# EAGLE schematic Oscilloscope (EAGLE 9.7.0)

## Sheet 1 of 3
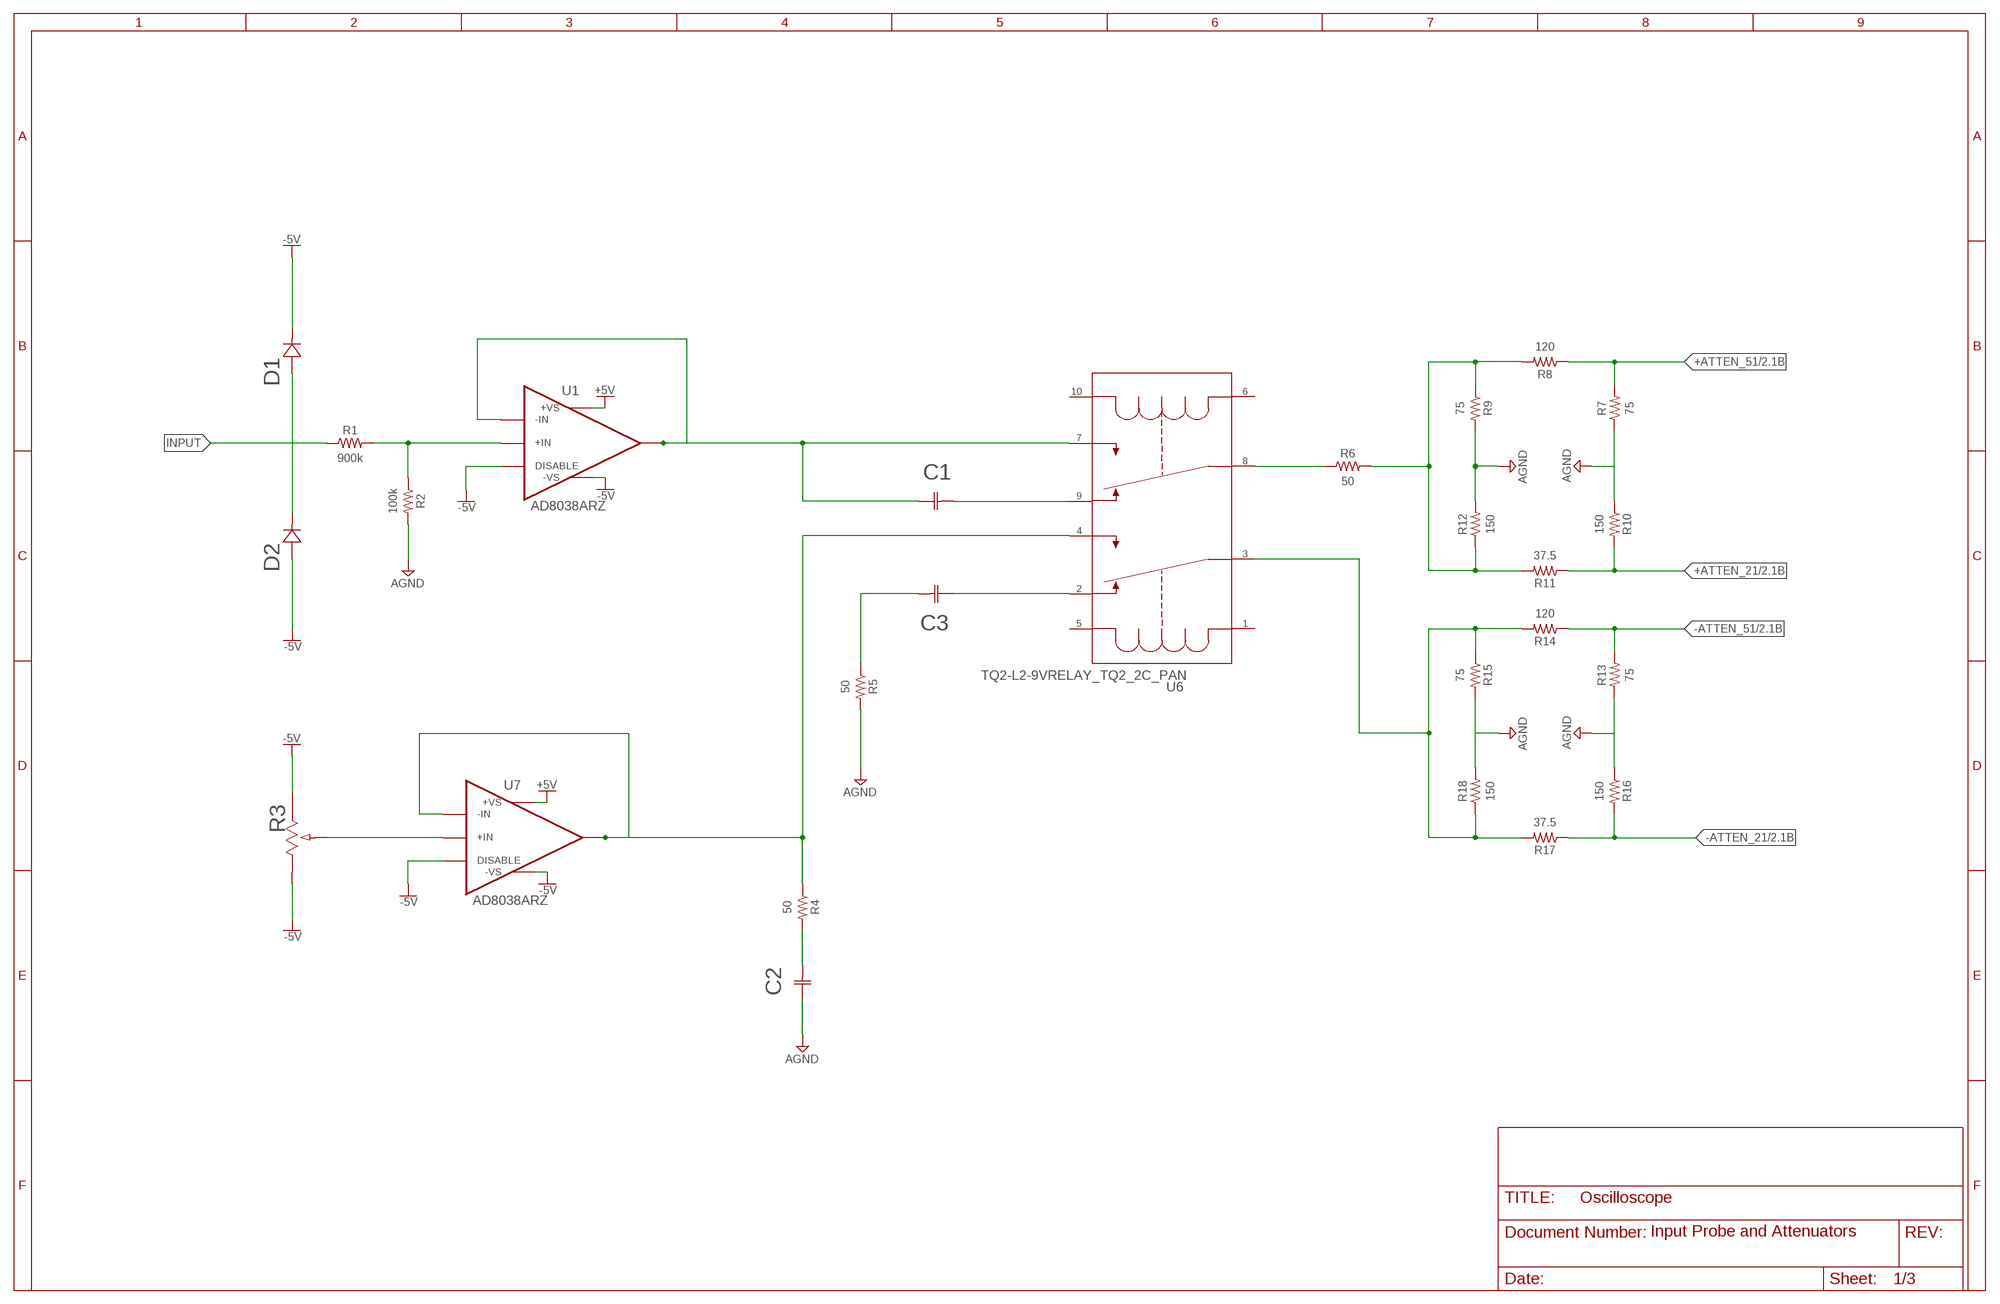
[diagram p0: schematic, sheet 1]

### Parts
C1  C1005X7R1V104K050BBCAP_1005_TDK-L  [CAP_1005_TDK-L]
C2  C1005X7R1V104K050BBCAP_1005_TDK-L  [CAP_1005_TDK-L]
C3  C1005X7R1V104K050BBCAP_1005_TDK-L  [CAP_1005_TDK-L]
D1  NSR05F40NXT5GCR_NSR05_ONS-L  [CR_NSR05_ONS-L]
D2  NSR05F40NXT5GCR_NSR05_ONS-L  [CR_NSR05_ONS-L]
R1  900k  R-US_AXIAL-7.2MM-PITCH  [RESAD724W46L381D178B]
R2  100k  R-US_AXIAL-7.2MM-PITCH  [RESAD724W46L381D178B]
R3  3386P-1-103TLFPOT_3386P  [POT_3386P]
R4  50  R-US_AXIAL-7.2MM-PITCH  [RESAD724W46L381D178B]
R5  50  R-US_AXIAL-7.2MM-PITCH  [RESAD724W46L381D178B]
R6  50  R-US_AXIAL-7.2MM-PITCH  [RESAD724W46L381D178B]
R7  75  R-US_AXIAL-7.2MM-PITCH  [RESAD724W46L381D178B]
R8  120  R-US_AXIAL-7.2MM-PITCH  [RESAD724W46L381D178B]
R9  75  R-US_AXIAL-7.2MM-PITCH  [RESAD724W46L381D178B]
R10  150  R-US_AXIAL-7.2MM-PITCH  [RESAD724W46L381D178B]
R11  37.5  R-US_AXIAL-7.2MM-PITCH  [RESAD724W46L381D178B]
R12  150  R-US_AXIAL-7.2MM-PITCH  [RESAD724W46L381D178B]
R13  75  R-US_AXIAL-7.2MM-PITCH  [RESAD724W46L381D178B]
R14  120  R-US_AXIAL-7.2MM-PITCH  [RESAD724W46L381D178B]
R15  75  R-US_AXIAL-7.2MM-PITCH  [RESAD724W46L381D178B]
R16  150  R-US_AXIAL-7.2MM-PITCH  [RESAD724W46L381D178B]
R17  37.5  R-US_AXIAL-7.2MM-PITCH  [RESAD724W46L381D178B]
R18  150  R-US_AXIAL-7.2MM-PITCH  [RESAD724W46L381D178B]
U1  AD8038ARZ  [SOIC127P600X175-8N]
U6  TQ2-L2-9VRELAY_TQ2_2C_PAN  [RELAY_TQ2_2C_PAN]
U7  AD8038ARZ  [SOIC127P600X175-8N]

### Nets
+5V: U1.7(+VS) U7.7(+VS) ; also sheet 2,3
+ATTEN_21: R10.2 R11.1 ; also sheet 2
+ATTEN_51: R7.2 R8.1 ; also sheet 2
-5V: D1.1 D2.2 R3.1 R3.3 U1.4(-VS) U1.8(DISABLE) U7.4(-VS) U7.8(DISABLE) ; also sheet 2,3
-ATTEN_21: R16.2 R17.1 ; also sheet 2
-ATTEN_51: R13.2 R14.1 ; also sheet 2
AGND: C2.1 R5.2 R7.1 R9.2 R10.1 R12.2 R13.1 R15.2 R16.1 R18.2 ; also sheet 2,3
AGND1: R6.2 R8.2 R9.1 R11.2 R12.1
AGND3: R14.2 R15.1 R17.2 R18.1 U6.3(3_2)
INPUT: R1.1
N$1: R1.2 R2.1 U1.3(+IN)
N$2: C1.2 U6.9
N$3: R2.2 ; supply symbol labelled AGND
N$4: R3.2 U7.3(+IN)
N$5: D1.2 D2.1
N$7: C1.1 U1.2(-IN) U1.6(VOUT) U6.7
N$8: R4.1 U6.4 U7.2(-IN) U7.6(VOUT)
N$9: C2.2 R4.2
N$10: C3.1 U6.2
N$11: C3.2 R5.1
N$12: R6.1 U6.8
Unconnected: U6.1 U6.5 U6.6 U6.10

### Notes on the sheet
- Input Probe and Attenuators

## Sheet 2 of 3
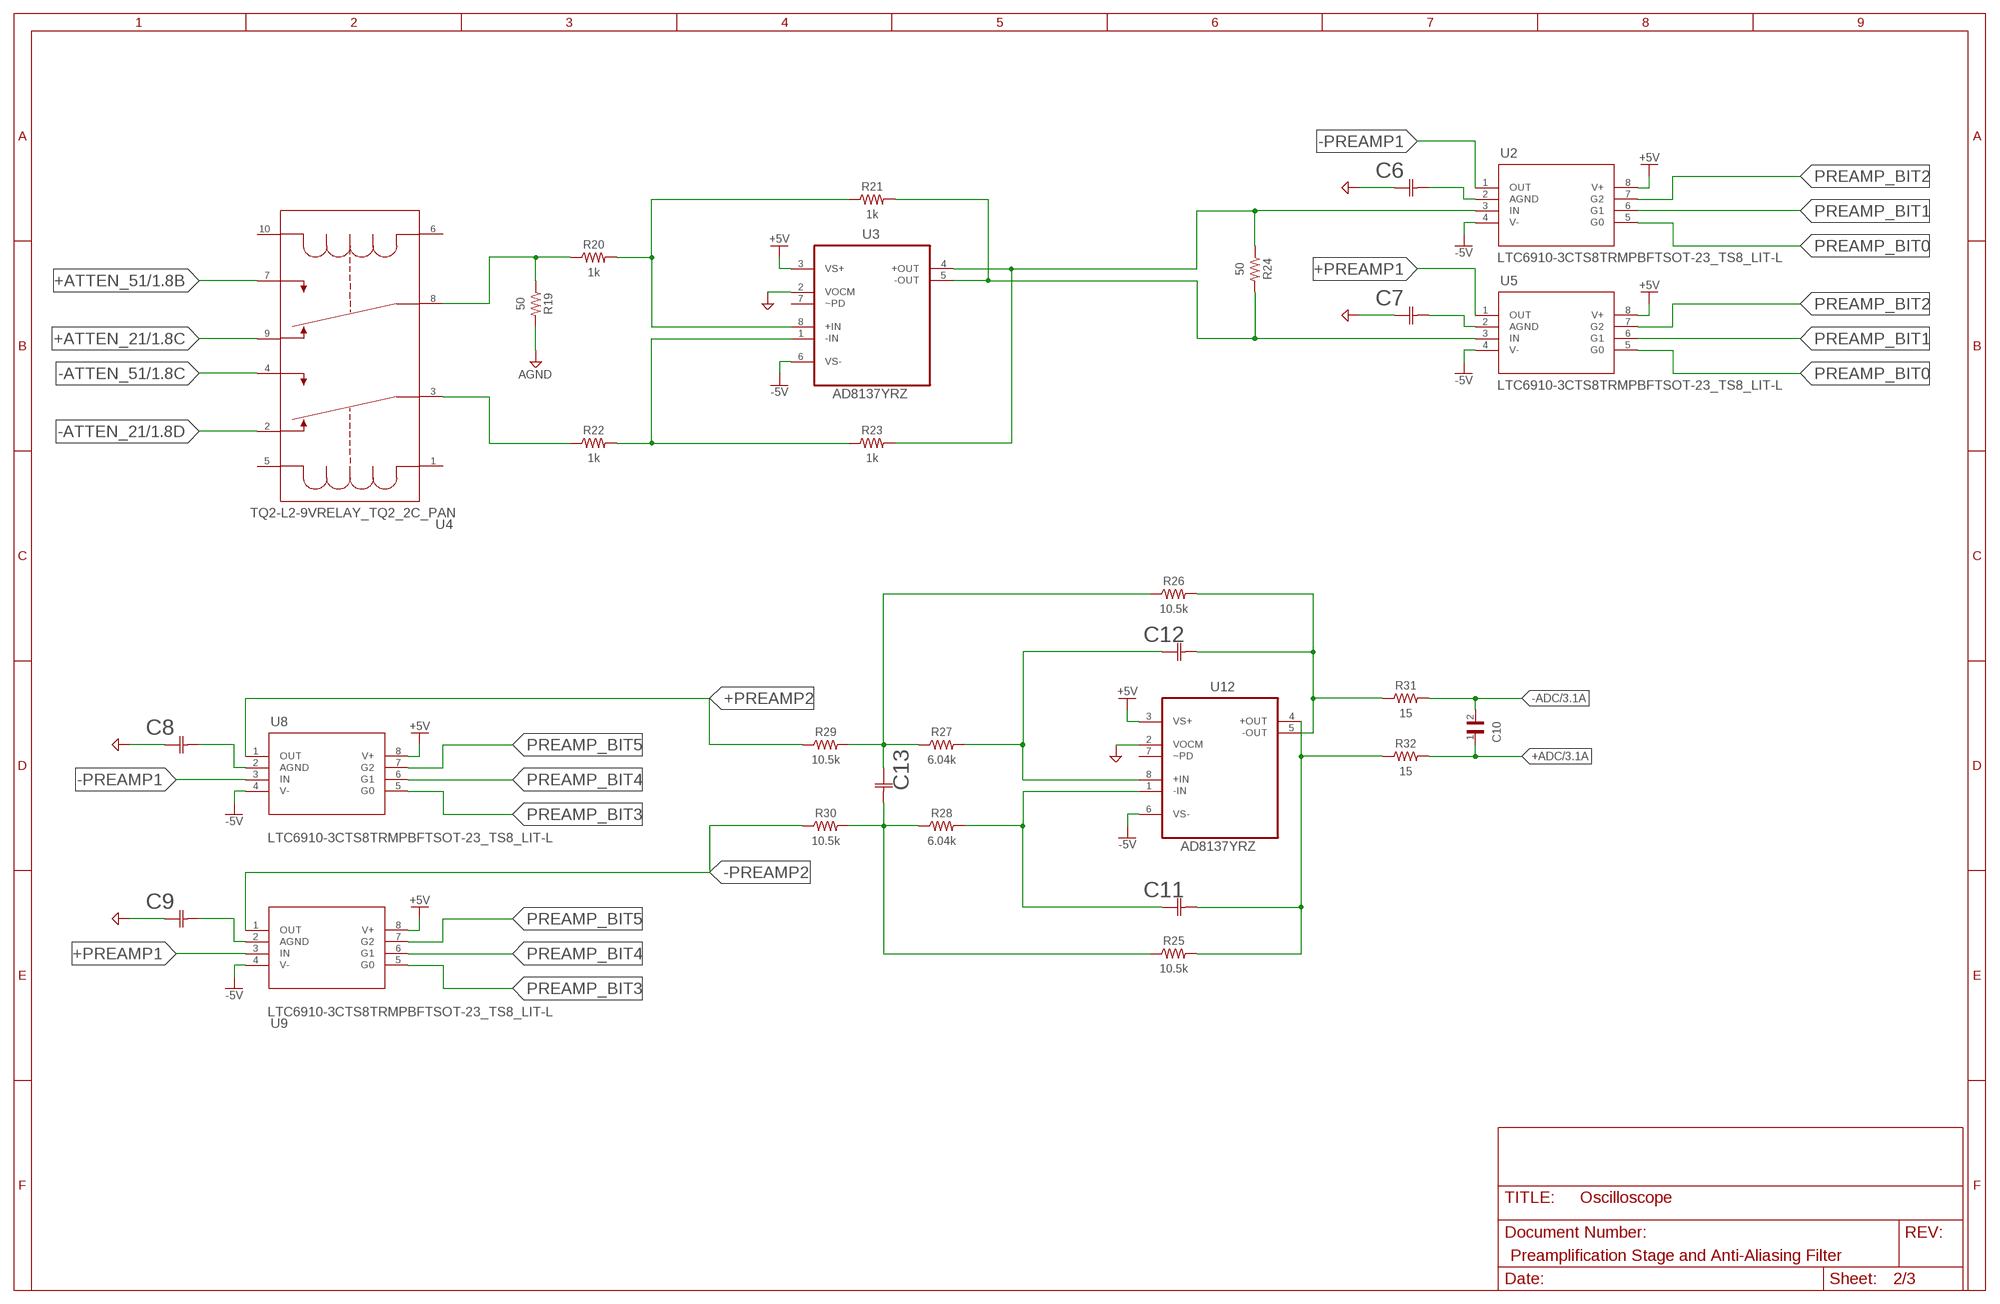
[diagram p1: schematic, sheet 2]

### Parts
C6  C0402C105K9PACTUCAPC10555_55N_KEM-L  [CAPC10555_55N_KEM-L]
C7  C0402C105K9PACTUCAPC10555_55N_KEM-L  [CAPC10555_55N_KEM-L]
C8  C0402C105K9PACTUCAPC10555_55N_KEM-L  [CAPC10555_55N_KEM-L]
C9  C0402C105K9PACTUCAPC10555_55N_KEM-L  [CAPC10555_55N_KEM-L]
C10  CC0603JRNPO9BN501  [CAPC1608X90]
C11  CC0603JRNPO9BN100CAP_CC0603_YAG-L  [CAP_CC0603_YAG-L]
C12  CC0603JRNPO9BN100CAP_CC0603_YAG-L  [CAP_CC0603_YAG-L]
C13  CC0603JRNPO9BN200YAG_CC0603_YAG-L  [YAG_CC0603_YAG-L]
R19  50  R-US_AXIAL-7.2MM-PITCH  [RESAD724W46L381D178B]
R20  1k  R-US_AXIAL-7.2MM-PITCH  [RESAD724W46L381D178B]
R21  1k  R-US_AXIAL-7.2MM-PITCH  [RESAD724W46L381D178B]
R22  1k  R-US_AXIAL-7.2MM-PITCH  [RESAD724W46L381D178B]
R23  1k  R-US_AXIAL-7.2MM-PITCH  [RESAD724W46L381D178B]
R24  50  R-US_AXIAL-7.2MM-PITCH  [RESAD724W46L381D178B]
R25  10.5k  R-US_AXIAL-7.2MM-PITCH  [RESAD724W46L381D178B]
R26  10.5k  R-US_AXIAL-7.2MM-PITCH  [RESAD724W46L381D178B]
R27  6.04k  R-US_AXIAL-7.2MM-PITCH  [RESAD724W46L381D178B]
R28  6.04k  R-US_AXIAL-7.2MM-PITCH  [RESAD724W46L381D178B]
R29  10.5k  R-US_AXIAL-7.2MM-PITCH  [RESAD724W46L381D178B]
R30  10.5k  R-US_AXIAL-7.2MM-PITCH  [RESAD724W46L381D178B]
R31  15  R-US_AXIAL-7.2MM-PITCH  [RESAD724W46L381D178B]
R32  15  R-US_AXIAL-7.2MM-PITCH  [RESAD724W46L381D178B]
U2  LTC6910-3CTS8TRMPBFTSOT-23_TS8_LIT-L  [TSOT-23_TS8_LIT-L]
U3  AD8137YRZ  [SOIC127P600X175-8N]
U4  TQ2-L2-9VRELAY_TQ2_2C_PAN  [RELAY_TQ2_2C_PAN]
U5  LTC6910-3CTS8TRMPBFTSOT-23_TS8_LIT-L  [TSOT-23_TS8_LIT-L]
U8  LTC6910-3CTS8TRMPBFTSOT-23_TS8_LIT-L  [TSOT-23_TS8_LIT-L]
U9  LTC6910-3CTS8TRMPBFTSOT-23_TS8_LIT-L  [TSOT-23_TS8_LIT-L]
U12  AD8137YRZ  [SOIC127P600X175-8N]

### Nets
+5V: U2.8(V+) U3.3(VS+) U5.8(V+) U8.8(V+) U9.8(V+) U12.3(VS+) ; also sheet 1,3
+ADC: C10.1 R32.2 ; also sheet 3
+ATTEN_21: U4.9 ; also sheet 1
+ATTEN_51: U4.7 ; also sheet 1
+PREAMP1: U5.1(OUT) U9.3(IN)
+PREAMP2: R29.1 U8.1(OUT)
-5V: U2.4(V-) U3.6(VS-) U5.4(V-) U8.4(V-) U9.4(V-) U12.6(VS-) ; also sheet 1,3
-ADC: C10.2 R31.2 ; also sheet 3
-ATTEN_21: U4.2 ; also sheet 1
-ATTEN_51: U4.4 ; also sheet 1
-PREAMP1: U2.1(OUT) U8.3(IN)
-PREAMP2: R30.1 U9.1(OUT)
AGND: C6.1 C7.1 C8.1 C9.1 R19.2 U3.2(VOCM) U12.2(VOCM) ; also sheet 1,3
N$13: C6.2 U2.2(AGND)
N$14: R19.1 R20.1 U4.8
N$15: R22.1 U4.3(3_2)
N$18: R20.2 R21.1 U3.8(+IN)
N$19: C7.2 U5.2(AGND)
N$20: R22.2 R23.1 U3.1(-IN)
N$25: R21.2 R23.2 R24.1 R24.2 U2.3(IN) U3.4(+OUT) U3.5(-OUT) U5.3(IN)
N$26: C8.2 U8.2(AGND)
N$27: C9.2 U9.2(AGND)
N$28: C13.1 R26.1 R27.1 R29.2
N$29: C12.1 R27.2 U12.8(+IN)
N$30: C11.1 R28.2 U12.1(-IN)
N$33: C13.2 R25.1 R28.1 R30.2
N$61: C12.2 R26.2 R31.1 U12.5(-OUT)
N$62: C11.2 R25.2 R32.1 U12.4(+OUT)
PREAMP_BIT0: U2.5(G0) U5.5(G0)
PREAMP_BIT1: U2.6(G1) U5.6(G1)
PREAMP_BIT2: U2.7(G2) U5.7(G2)
PREAMP_BIT3: U8.5(G0) U9.5(G0)
PREAMP_BIT4: U8.6(G1) U9.6(G1)
PREAMP_BIT5: U8.7(G2) U9.7(G2)
Unconnected: U3.7(~PD) U4.1 U4.5 U4.6 U4.10 U12.7(~PD)

### Notes on the sheet
- Preamplification Stage and Anti-Aliasing Filter

## Sheet 3 of 3
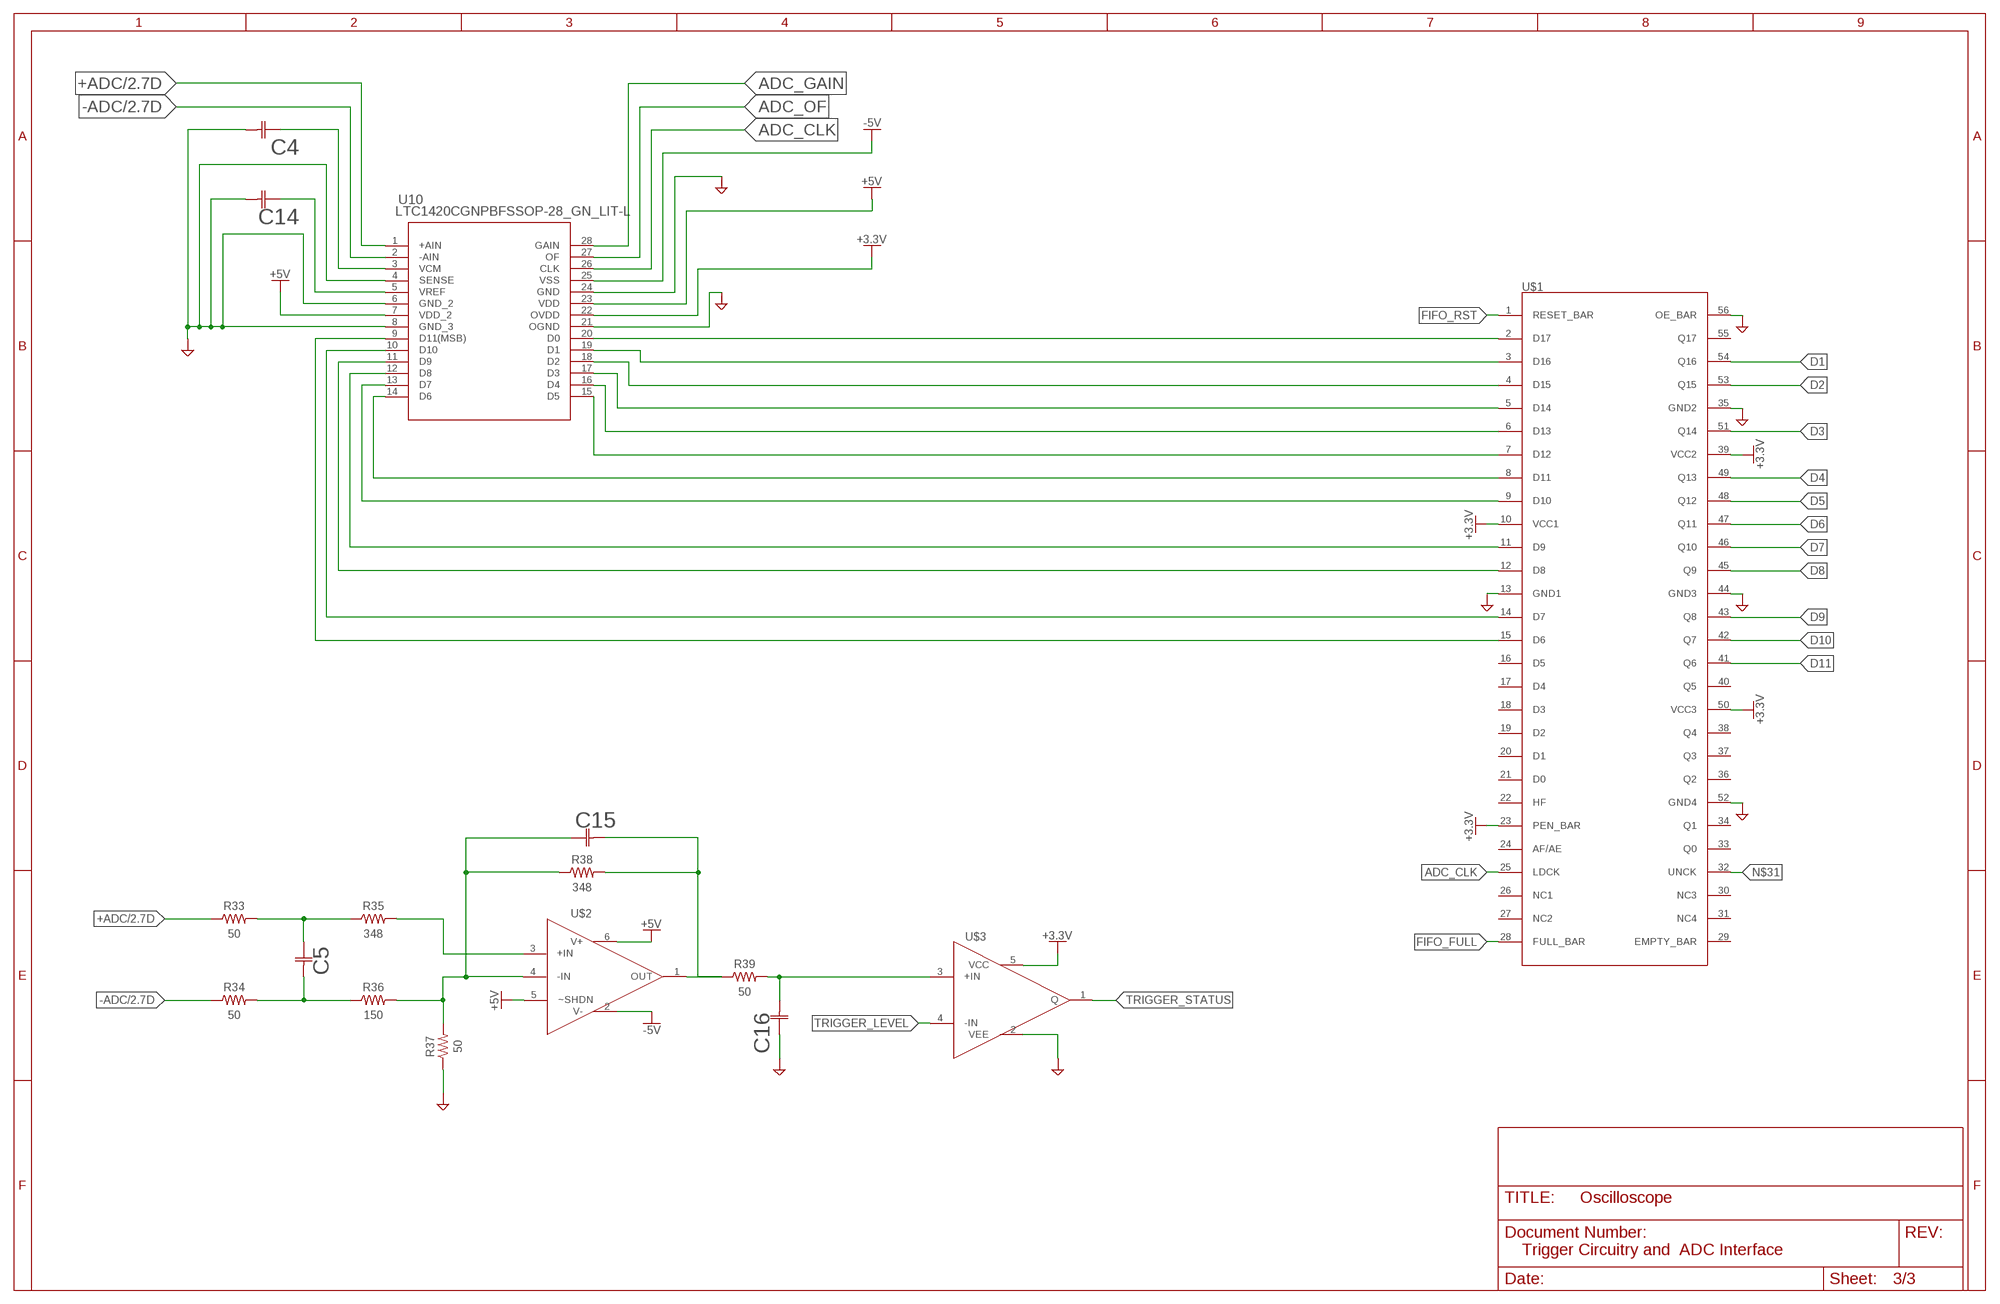
[diagram p2: schematic, sheet 3]

### Parts
C4  C0402C105K9PACTUCAPC10555_55N_KEM-L  [CAPC10555_55N_KEM-L]
C5  CC0603JRNP09BN180BCC0603N_YAG-L  [CC0603N_YAG-L]
C14  C0402C105K9PACTUCAPC10555_55N_KEM-L  [CAPC10555_55N_KEM-L]
C15  CC0603JRNP09BN180BCC0603N_YAG-L  [CC0603N_YAG-L]
C16  CC0603JRNPO9BN101CAP_O9BN101_YAG-L  [CAP_O9BN101_YAG-L]
R33  50  R-US_AXIAL-7.2MM-PITCH  [RESAD724W46L381D178B]
R34  50  R-US_AXIAL-7.2MM-PITCH  [RESAD724W46L381D178B]
R35  348  R-US_AXIAL-7.2MM-PITCH  [RESAD724W46L381D178B]
R36  150  R-US_AXIAL-7.2MM-PITCH  [RESAD724W46L381D178B]
R37  50  R-US_AXIAL-7.2MM-PITCH  [RESAD724W46L381D178B]
R38  348  R-US_AXIAL-7.2MM-PITCH  [RESAD724W46L381D178B]
R39  50  R-US_AXIAL-7.2MM-PITCH  [RESAD724W46L381D178B]
U10  LTC1420CGNPBFSSOP-28_GN_LIT-L  [SSOP-28_GN_LIT-L]
U$1  SN74ALVC7804  [SOP63P1035X279-56N]
U$2  LTC6228  [TSOT-23_S6]
U$3  LTC6752  [SOT95P280X100-5N]

### Nets
+3.3V: U10.22(OVDD)
+5V: U10.7(VDD_2) U10.23(VDD) U$2.5(~SHDN) U$2.6(V+) ; also sheet 1,2
+ADC: R33.1 U10.1(+AIN) ; also sheet 2
+ADC5: C5.1 R33.2 R35.1
+ADC6: C5.2 R34.2 R36.1
-5V: U10.25(VSS) U$2.2(V-) ; also sheet 1,2
-ADC: R34.1 U10.2(-AIN) ; also sheet 2
ADC_CLK: U10.26(CLK) U$1.25(LDCK)
ADC_GAIN: U10.28(GAIN)
ADC_OF: U10.27(OF)
AGND: C16.1 R37.1 U10.24(GND) U$1.13(GND1) U$3.2(VEE) ; also sheet 1,2
D1: U$1.54(Q16)
D2: U$1.53(Q15)
D3: U$1.51(Q14)
D4: U$1.49(Q13)
D5: U$1.48(Q12)
D6: U$1.47(Q11)
D7: U$1.46(Q10)
D8: U$1.45(Q9)
D9: U$1.43(Q8)
D10: U$1.42(Q7)
D11: U$1.41(Q6)
FIFO_FULL: U$1.28(FULL_BAR)
FIFO_RST: U$1.1(RESET_BAR)
N$6: U10.20(D0) U$1.2(D17)
N$21: U$1.23(PEN_BAR) U$1.39(VCC2) U$1.50(VCC3) ; supply symbol labelled +3.3V
N$22: U10.19(D1) U$1.3(D16)
N$23: U$1.10(VCC1) ; supply symbol labelled +3.3V
N$24: C4.2 C14.2 U10.4(SENSE) U10.6(GND_2) U10.8(GND_3) ; supply symbol labelled AGND
N$31: U$1.32(UNCK)
N$32: U10.18(D2) U$1.4(D15)
N$34: U10.17(D3) U$1.5(D14)
N$35: R35.2 U$2.3(+IN)
N$36: U10.16(D4) U$1.6(D13)
N$37: U10.15(D5) U$1.7(D12)
N$38: U10.14(D6) U$1.8(D11)
N$39: U10.13(D7) U$1.9(D10)
N$40: U10.12(D8) U$1.11(D9)
N$41: U10.11(D9) U$1.12(D8)
N$42: U10.10(D10) U$1.14(D7)
N$43: U10.9(D11(MSB)) U$1.15(D6)
N$44: C15.1 R36.2 R37.2 R38.1 U$2.4(-IN)
N$45: U10.21(OGND) U$1.35(GND2) U$1.44(GND3) U$1.52(GND4) U$1.56(OE_BAR) ; supply symbol labelled AGND
N$46: C15.2 R38.2 R39.1 U$2.1(OUT)
N$47: C16.2 R39.2 U$3.3(+IN)
N$48: U$3.5(VCC) ; supply symbol labelled +3.3V
TRIGGER_LEVEL: U$3.4(-IN)
TRIGGER_STATUS: U$3.1(Q)
VCM: C4.1 U10.3(VCM)
VREF: C14.1 U10.5(VREF)
Unconnected: U$1.16(D5) U$1.17(D4) U$1.18(D3) U$1.19(D2) U$1.20(D1) U$1.21(D0) U$1.22(HF) U$1.24(AF/AE) U$1.26(NC1) U$1.27(NC2) U$1.29(EMPTY_BAR) U$1.30(NC3) U$1.31(NC4) U$1.33(Q0) U$1.34(Q1) U$1.36(Q2) U$1.37(Q3) U$1.38(Q4) U$1.40(Q5) U$1.55(Q17)

### Notes on the sheet
- Trigger Circuitry and  ADC Interface

## Library data of the parts
C1-C3 = C1005X7R1V04K050BB:C1005X7R1V104K050BB; COPYRIGHT: Copyright (C) 2023 Ultra Librarian. All rights reserved.; MANUFACTURER_PART_NUMBER: C1005X7R1V104K050BB; MFR_NAME: TDK
C4 C6-C9 C14 = Oscilloscope_Components:C0402C105K9PACTU; COPYRIGHT: Copyright (C) 2023 Ultra Librarian. All rights reserved.; MANUFACTURER_PART_NUMBER: C0402C105K9PACTU; MFR_NAME: Kemet
C5 C15 = Oscilloscope_Components:CC0603JRNP09BN180B; COPYRIGHT: Copyright (C) 2023 Ultra Librarian. All rights reserved.; MANUFACTURER_PART_NUMBER: CC0603JRNP09BN180B; MFR_NAME: Yageo
C10 = Oscilloscope_Components:CC0603JRNPO9BN501: CAP CER 500PF 50V NPO 0603
C11 C12 = Oscilloscope_Components:CC0603JRNPO9BN100; COPYRIGHT: Copyright (C) 2023 Ultra Librarian. All rights reserved.; MANUFACTURER_PART_NUMBER: CC0603JRNPO9BN100; MFR_NAME: Yageo
C13 = Oscilloscope_Components:CC0603JRNPO9BN200; COPYRIGHT: Copyright (C) 2023 Ultra Librarian. All rights reserved.; MANUFACTURER_PART_NUMBER: CC0603JRNPO9BN200; MFR_NAME: Yageo
C16 = Oscilloscope_Components:CC0603JRNPO9BN101; COPYRIGHT: Copyright (C) 2023 Ultra Librarian. All rights reserved.; MANUFACTURER_PART_NUMBER: CC0603JRNPO9BN101; MFR_NAME: Yageo
D1 D2 = 2023-10-08_22-21-38_Library:NSR05F40NXT5G; COPYRIGHT: Copyright (C) 2023 Ultra Librarian. All rights reserved.; MANUFACTURER_PART_NUMBER: NSR05F40NXT5G; MFR_NAME: onsemi
R1 R2 R4-R39 = Resistor:R-US: Resistor Fixed - ANSI; CATEGORY: Resistor; SUB-CATEGORY: Fixed
R3 = 3386P-1-103TLF:3386P-1-103TLF; COPYRIGHT: Copyright (C) 2023 Ultra Librarian. All rights reserved.; MANUFACTURER_PART_NUMBER: 3386P-1-103TLF; MFR_NAME: Bourns Electronics
U1 U7 = Oscilloscope_Components:AD8038ARZ: Voltage Feedback Amplifiers Check availability <https://pricing.snapeda.com/parts/AD8038ARZ/Analog%20Devices/view-part?ref=eda>; AVAILABILITY: In Stock; CHECK_PRICES: https://www.snapeda.com/parts/AD8038ARZ/Analog+Devices/view-part/?ref=eda; DESCRIPTION: Low Power, 350 MHz Voltage Feedback Amplifiers; MF: Analog Devices; MP: AD8038ARZ; PACKAGE: SOIC-8 Analog Devices; PRICE: None; PURCHASE-URL: https://www.snapeda.com/api/url_track_click_mouser/?unipart_id=429233&manufacturer=Analog Devices&part_name=AD8038ARZ&search_term=ad8038; SNAPEDA_LINK: https://www.snapeda.com/parts/AD8038ARZ/Analog+Devices/view-part/?ref=snap
U2 U5 U8 U9 = Oscilloscope_Components:LTC6910-3CTS8TRMPBF; COPYRIGHT: Copyright (C) 2023 Ultra Librarian. All rights reserved.; MANUFACTURER_PART_NUMBER: LTC6910-3CTS8#TRMPBF; MFR_NAME: Analog Devices Inc
U3 U12 = Oscilloscope_Components:AD8137YRZ: Low Cost, Low Power, Differential ADC Driver Check availability <https://pricing.snapeda.com/parts/AD8137YRZ/Analog%20Devices/view-part?ref=eda>; AVAILABILITY: In Stock; CHECK_PRICES: https://www.snapeda.com/parts/AD8137YRZ/Analog+Devices/view-part/?ref=eda; DESCRIPTION: Low Cost, Low Power Differential ADC Driver; MF: Analog Devices; MP: AD8137YRZ; PACKAGE: SOIC-8 Analog Devices; PRICE: None; PURCHASE-URL: https://www.snapeda.com/api/url_track_click_mouser/?unipart_id=1160134&manufacturer=Analog Devices&part_name=AD8137YRZ&search_term=ad8137; SNAPEDA_LINK: https://www.snapeda.com/parts/AD8137YRZ/Analog+Devices/view-part/?ref=snap
U4 U6 = RELAY_TQ2_L2_9V:TQ2-L2-9V; COPYRIGHT: Copyright (C) 2023 Ultra Librarian. All rights reserved.; MANUFACTURER_PART_NUMBER: TQ2-L2-9V; MFR_NAME: Panasonic
U10 = Oscilloscope_Components:LTC1420CGNPBF; COPYRIGHT: Copyright (C) 2023 Ultra Librarian. All rights reserved.; MANUFACTURER_PART_NUMBER: LTC1420CGN#PBF; MFR_NAME: Analog Devices Inc
U$1 = Oscilloscope_Components:SN74ALVC7804: 512 X 18 FIFO Memory Storage Device
U$2 = Oscilloscope_Components:LTC6228: Highspeed Op Amp for Differential to Single-Ended Conversion
U$3 = Oscilloscope_Components:LTC6752: 280MHz, 2.9ns Comparator with CMOS output